# EAGLE schematic BX31 IoT Board (EAGLE 7.7.0)
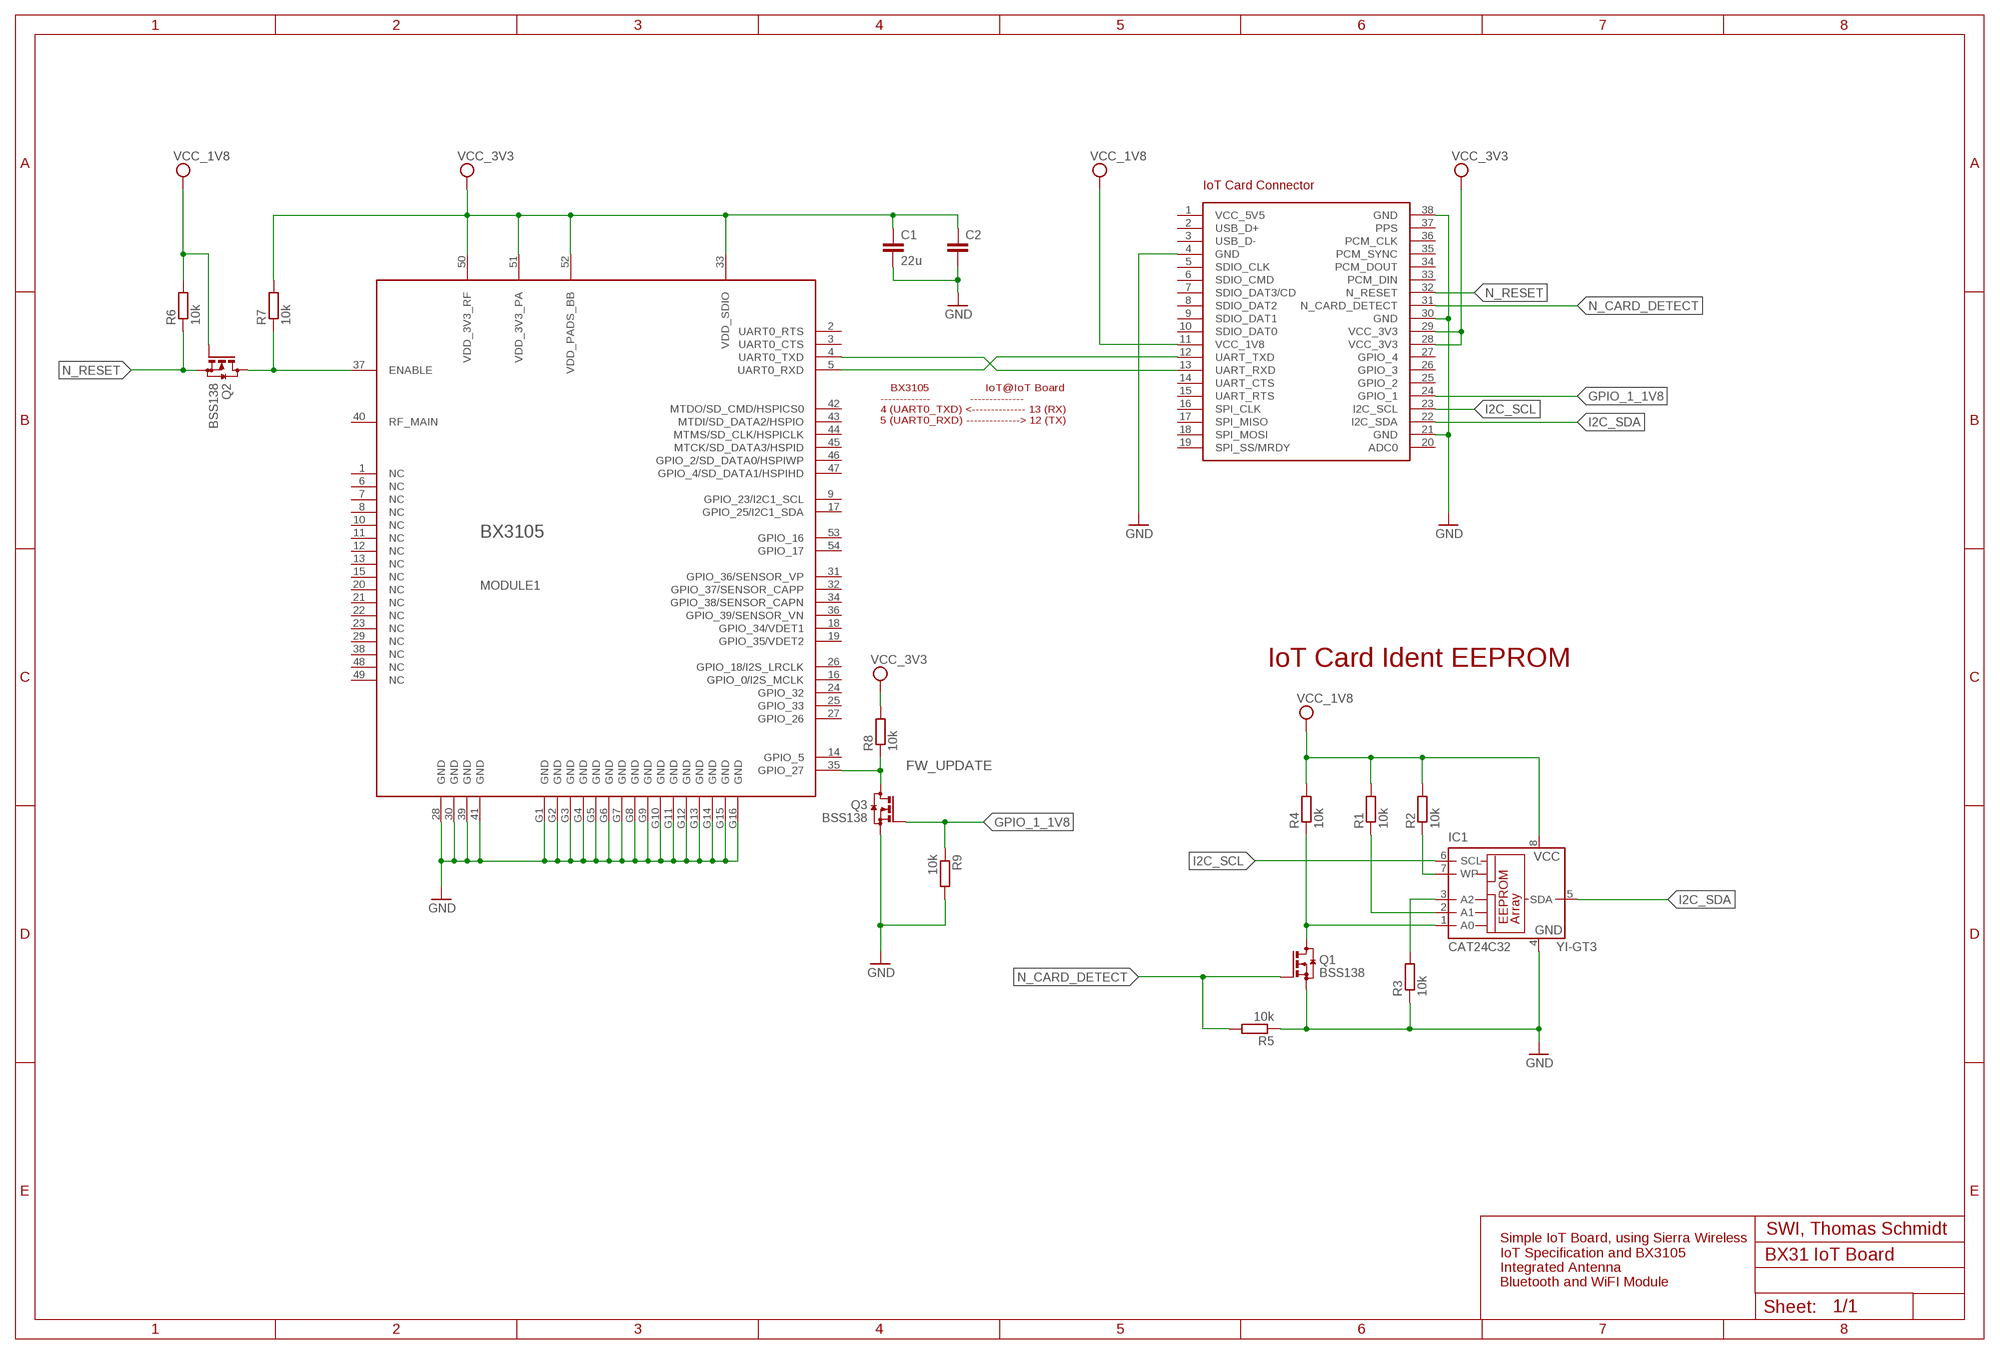
[diagram p0: schematic, sheet 1]

## Parts
C1  22u  C-EUC0805K  [C0805K]
C2  C-EUC0603K  [C0603K]
IC1  CAT24C32 YI-GT3  24C64ST  [TSSOP8]
MODULE1  BX3105  [BX3105]
Q1  BSS138  BSS123  [SOT23]
Q2  BSS138  BSS123  [SOT23]
Q3  BSS138  BSS123  [SOT23]
R1  10k  R-EU_R0402  [R0402]
R2  10k  R-EU_R0402  [R0402]
R3  10k  R-EU_R0402  [R0402]
R4  10k  R-EU_R0402  [R0402]
R5  10k  R-EU_R0402  [R0402]
R6  10k  R-EU_R0402  [R0402]
R7  10k  R-EU_R0402  [R0402]
R8  10k  R-EU_R0402  [R0402]
R9  10k  R-EU_R0402  [R0402]
U$1  IOT  [IOT]

## Nets
BX-RX_IOT-TX: MODULE1.5(UART0_RXD) U$1.12(UART_TXD)
BX-TX_IOT-RX: MODULE1.4(UART0_TXD) U$1.13(UART_RXD)
EEPROM_A0: IC1.1(A0) Q1.3(D) R4.1
EEPROM_A1: IC1.2(A1) R1.1
EEPROM_A2: IC1.3(A2) R3.2
EEPROM_WP: IC1.7(WP) R2.1
ENABLE: MODULE1.37(ENABLE) Q2.3(D) R7.1
FW_UPDATE: MODULE1.35(GPIO_27) Q3.3(D) R8.1
GND: C1.2 C2.2 IC1.4(GND) MODULE1.28(GND) MODULE1.30(GND) MODULE1.39(GND) MODULE1.41(GND) MODULE1.G1(GND) MODULE1.G2(GND) MODULE1.G3(GND) MODULE1.G4(GND) MODULE1.G5(GND) MODULE1.G6(GND) MODULE1.G7(GND) MODULE1.G8(GND) MODULE1.G9(GND) MODULE1.G10(GND) MODULE1.G11(GND) MODULE1.G12(GND) MODULE1.G13(GND) MODULE1.G14(GND) MODULE1.G15(GND) MODULE1.G16(GND) Q1.2(S) Q3.2(S) R3.1 R5.1 R9.2 U$1.4(GND) U$1.21(GND) U$1.30(GND) U$1.38(GND)
GPIO_1_1V8: Q3.1(G) R9.1 U$1.24(GPIO_1)
I2C_SCL: IC1.6(SCL) U$1.23(I2C_SCL)
I2C_SDA: IC1.5(SDA) U$1.22(I2C_SDA)
N_CARD_DETECT: Q1.1(G) R5.2 U$1.31(N_CARD_DETECT)
N_RESET: Q2.2(S) R6.1 U$1.32(N_RESET)
VCC_1V8: IC1.8(VCC) Q2.1(G) R1.2 R2.2 R4.2 R6.2 U$1.11(VCC_1V8)
VCC_3V3: C1.1 C2.1 MODULE1.33(VDD_SDIO) MODULE1.50(VDD_3V3_RF) MODULE1.51(VDD_3V3_PA) MODULE1.52(VDD_PADS_BB) R7.2 R8.2 U$1.28(VCC_3V3) U$1.29(VCC_3V3)
Unconnected: MODULE1.1(NC) MODULE1.2(UART0_RTS) MODULE1.3(UART0_CTS) MODULE1.6(NC) MODULE1.7(NC) MODULE1.8(NC) MODULE1.9(GPIO_23/I2C1_SCL) MODULE1.10(NC) MODULE1.11(NC) MODULE1.12(NC) MODULE1.13(NC) MODULE1.14(GPIO_5) MODULE1.15(NC) MODULE1.16(GPIO_0/I2S_MCLK) MODULE1.17(GPIO_25/I2C1_SDA) MODULE1.18(GPIO_34/VDET1) MODULE1.19(GPIO_35/VDET2) MODULE1.20(NC) MODULE1.21(NC) MODULE1.22(NC) MODULE1.23(NC) MODULE1.24(GPIO_32) MODULE1.25(GPIO_33) MODULE1.26(GPIO_18/I2S_LRCLK) MODULE1.27(GPIO_26) MODULE1.29(NC) MODULE1.31(GPIO_36/SENSOR_VP) MODULE1.32(GPIO_37/SENSOR_CAPP) MODULE1.34(GPIO_38/SENSOR_CAPN) MODULE1.36(GPIO_39/SENSOR_VN) MODULE1.38(NC) MODULE1.40(RF_MAIN) MODULE1.42(MTDO/SD_CMD/HSPICS0) MODULE1.43(MTDI/SD_DATA2/HSPIO) MODULE1.44(MTMS/SD_CLK/HSPICLK) MODULE1.45(MTCK/SD_DATA3/HSPID) MODULE1.46(GPIO_2/SD_DATA0/HSPIWP) MODULE1.47(GPIO_4/SD_DATA1/HSPIHD) MODULE1.48(NC) MODULE1.49(NC) MODULE1.53(GPIO_16) MODULE1.54(GPIO_17) U$1.2(USB_D+) U$1.3(USB_D-) U$1.5(SDIO_CLK) U$1.6(SDIO_CMD) U$1.7(SDIO_DAT3/CD) U$1.8(SDIO_DAT2) U$1.9(SDIO_DAT1) U$1.10(SDIO_DAT0) U$1.14(UART_CTS) U$1.15(UART_RTS) U$1.16(SPI_CLK) U$1.17(SPI_MISO) U$1.18(SPI_MOSI) U$1.19(SPI_SS/MRDY) U$1.20(ADC0) U$1.25(GPIO_2) U$1.26(GPIO_3) U$1.27(GPIO_4) U$1.33(PCM_DIN) U$1.34(PCM_DOUT) U$1.35(PCM_SYNC) U$1.36(PCM_CLK) U$1.37(PPS)

## Notes on the sheet
- BX3105                 IoT@IoT Board
  -------------            --------------
  4 (UART0_TXD) <-------------- 13 (RX)  
  5 (UART0_RXD) --------------> 12 (TX)
- IoT Card Ident EEPROM
- SWI, Thomas Schmidt
- Simple IoT Board, using Sierra Wireless 
  IoT Specification and BX3105 
  Integrated Antenna 
  Bluetooth and WiFI Module

## Power pins joined to a net without a drawn wire
VCC_5V5: U$1.1(VCC_5V5)

## Library data of the parts
C1 C2 = rcl:C-EU: CAPACITOR, European symbol
IC1 = microchip:24*: Serial EEPROM I2C; MPN: CAT24C64YI-GT3; OC_FARNELL: 1718133; OC_NEWARK: 08R5418
MODULE1 = Sierra BX310x:BX310: The BX310x is a low power, 802.11 b/g/n Wi-Fi and Bluetooth 4.2 combo module. It comes preloaded with Sierra Wireless software including TCP/IP and Bluetooth stacks, and is ideal for developers who want to quickly and cost effectively integrate Wi-Fi and Bluetooth functionality into their products. BX3105 includes an integrated PCB antenna. BX3100 has no integrated PCB antenna.
Q1-Q3 = transistor-small-signal:BSS123: N-CHANNEL MOS FET
R1-R9 = rcl:R-EU_: RESISTOR, European symbol
U$1 = IoT Card:IOT: IoT Expansion Card The IoT Expansion Card form factor represents an open hardware standard for sensors, network adapters, and other IoT technologies that can be "plugged" into host applications (e.g. hardware development board) to provide new features and interfaces. As a family, IoT Expansion Cards share a standardized footprint and pinout, with several interfaces to support various IoT technologies. Please check as well: http://mangoh.io/uploaded-documents/Reference/IoT%20Cards/IoT%20Card%20Specification/4117166_IoT%20Expansion%20Card%20Design%20Specification_r8.pdf